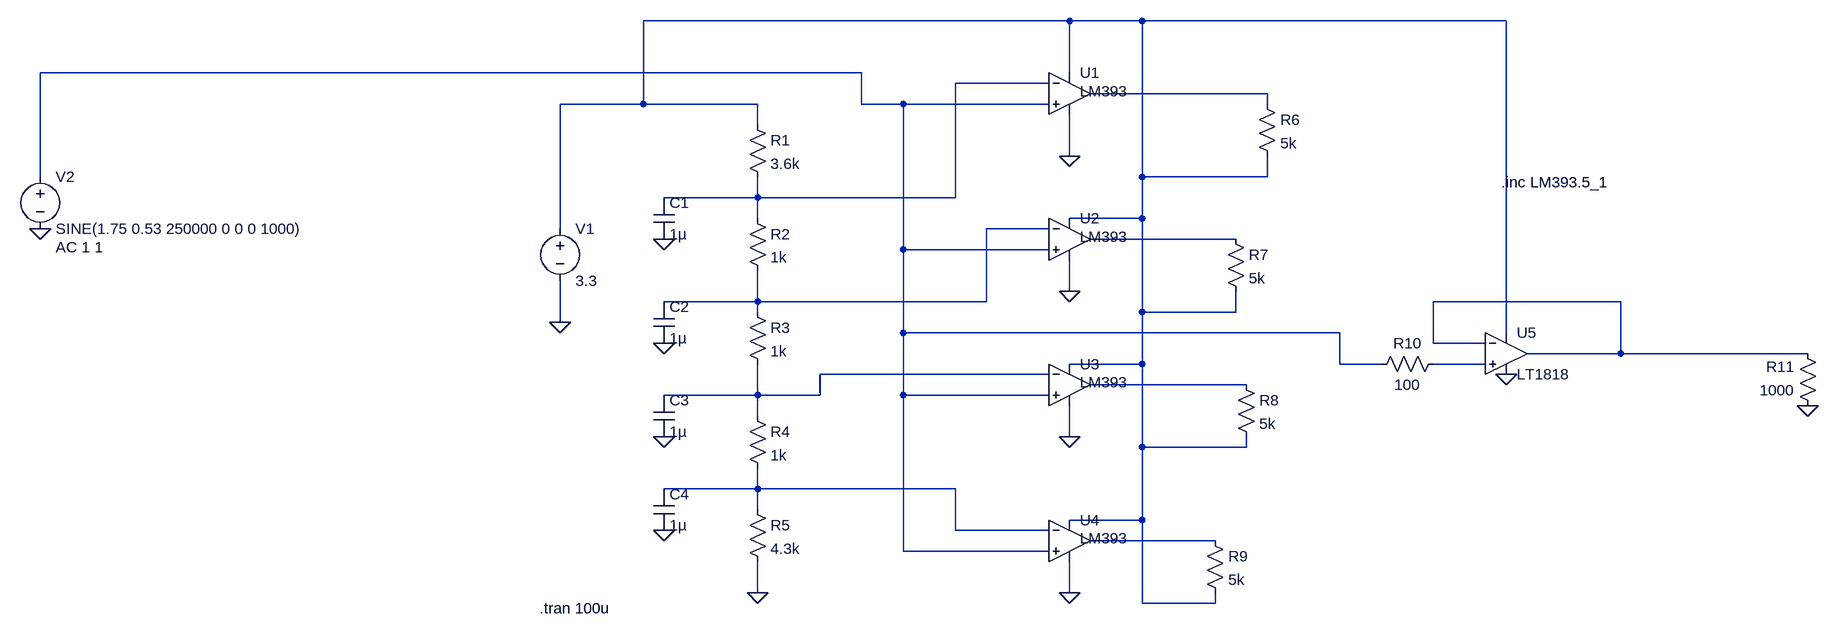
[diagram p0: schematic Comparator 2 bit ADC.asc]
Comparator 2 bit ADC.asc, the LTspice schematic file:
Version 4
SHEET 1 2020 728
WIRE 864 -192 208 -192
WIRE 976 -192 864 -192
WIRE 1536 -192 976 -192
WIRE 544 -112 -720 -112
WIRE 864 -112 864 -192
WIRE 832 -96 688 -96
WIRE 1168 -80 896 -80
WIRE 208 -64 208 -192
WIRE 208 -64 80 -64
WIRE 384 -64 208 -64
WIRE 544 -64 544 -112
WIRE 608 -64 544 -64
WIRE 832 -64 608 -64
WIRE 1168 -64 1168 -80
WIRE 384 -32 384 -64
WIRE 864 16 864 -48
WIRE -720 48 -720 -112
WIRE 976 48 976 -192
WIRE 1168 48 1168 16
WIRE 1168 48 976 48
WIRE 384 80 384 48
WIRE 384 80 240 80
WIRE 688 80 688 -96
WIRE 688 80 384 80
WIRE 384 112 384 80
WIRE 976 112 976 48
WIRE 976 112 864 112
WIRE 80 128 80 -64
WIRE 832 128 736 128
WIRE 1120 144 896 144
WIRE 608 160 608 -64
WIRE 832 160 608 160
WIRE 864 224 864 176
WIRE 384 240 384 192
WIRE 384 240 240 240
WIRE 736 240 736 128
WIRE 736 240 384 240
WIRE 1712 240 1424 240
WIRE 384 256 384 240
WIRE 976 256 976 112
WIRE 1120 256 1120 224
WIRE 1120 256 976 256
WIRE 80 272 80 208
WIRE 608 288 608 160
WIRE 1280 288 608 288
WIRE 1536 288 1536 -192
WIRE 1424 304 1424 240
WIRE 1504 304 1424 304
WIRE 1712 320 1712 240
WIRE 1712 320 1568 320
WIRE 2000 320 1712 320
WIRE 976 336 976 256
WIRE 976 336 864 336
WIRE 1280 336 1280 288
WIRE 1344 336 1280 336
WIRE 1504 336 1424 336
WIRE 832 352 480 352
WIRE 1136 368 896 368
WIRE 384 384 384 336
WIRE 384 384 240 384
WIRE 480 384 480 352
WIRE 480 384 384 384
WIRE 608 384 608 288
WIRE 832 384 608 384
WIRE 384 416 384 384
WIRE 864 448 864 400
WIRE 976 464 976 336
WIRE 1136 464 1136 448
WIRE 1136 464 976 464
WIRE 384 528 384 496
WIRE 384 528 240 528
WIRE 688 528 384 528
WIRE 384 560 384 528
WIRE 976 576 976 464
WIRE 976 576 864 576
WIRE 688 592 688 528
WIRE 832 592 688 592
WIRE 1088 608 896 608
WIRE 608 624 608 384
WIRE 832 624 608 624
WIRE 384 688 384 640
WIRE 864 688 864 640
WIRE 976 704 976 576
WIRE 1088 704 1088 688
WIRE 1088 704 976 704
FLAG 80 272 0
FLAG 384 688 0
FLAG 864 16 0
FLAG -720 128 0
FLAG 864 224 0
FLAG 864 448 0
FLAG 864 688 0
FLAG 240 144 0
FLAG 240 304 0
FLAG 240 448 0
FLAG 240 592 0
FLAG 1536 352 0
FLAG 2000 400 0
SYMBOL voltage 80 112 R0
WINDOW 123 0 0 Left 0
WINDOW 39 0 0 Left 0
SYMATTR InstName V1
SYMATTR Value 3.3
SYMBOL res 368 -48 R0
SYMATTR InstName R1
SYMATTR Value 3.6k
SYMBOL res 368 96 R0
SYMATTR InstName R2
SYMATTR Value 1k
SYMBOL res 368 240 R0
SYMATTR InstName R3
SYMATTR Value 1k
SYMBOL res 368 400 R0
SYMATTR InstName R4
SYMATTR Value 1k
SYMBOL res 368 544 R0
SYMATTR InstName R5
SYMATTR Value 4.3k
SYMBOL res 1152 -80 R0
SYMATTR InstName R6
SYMATTR Value 5k
SYMBOL voltage -720 32 R0
WINDOW 123 24 124 Left 2
WINDOW 39 0 0 Left 0
SYMATTR Value2 AC 1 1
SYMATTR InstName V2
SYMATTR Value SINE(1.75 0.53 250000 0 0 0 1000)
SYMBOL res 1104 128 R0
SYMATTR InstName R7
SYMATTR Value 5k
SYMBOL res 1120 352 R0
SYMATTR InstName R8
SYMATTR Value 5k
SYMBOL res 1072 592 R0
SYMATTR InstName R9
SYMATTR Value 5k
SYMBOL cap 224 80 R0
SYMATTR InstName C1
SYMATTR Value 1µ
SYMBOL cap 224 240 R0
SYMATTR InstName C2
SYMATTR Value 1µ
SYMBOL cap 224 384 R0
SYMATTR InstName C3
SYMATTR Value 1µ
SYMBOL cap 224 528 R0
SYMATTR InstName C4
SYMATTR Value 1µ
SYMBOL OpAmps\\UniversalOpAmp2 864 -80 R0
WINDOW 3 16 -4 Left 2
SYMATTR Value LM393
SYMATTR InstName U1
SYMATTR SpiceModel ""
SYMATTR Value2 ""
SYMATTR SpiceLine ""
SYMATTR SpiceLine2 ""
SYMBOL OpAmps\\UniversalOpAmp2 864 144 R0
WINDOW 3 16 -4 Left 2
SYMATTR Value LM393
SYMATTR InstName U2
SYMATTR SpiceModel ""
SYMATTR Value2 ""
SYMATTR SpiceLine ""
SYMATTR SpiceLine2 ""
SYMBOL OpAmps\\UniversalOpAmp2 864 368 R0
WINDOW 3 16 -4 Left 2
SYMATTR Value LM393
SYMATTR InstName U3
SYMATTR SpiceModel ""
SYMATTR Value2 ""
SYMATTR SpiceLine ""
SYMATTR SpiceLine2 ""
SYMBOL OpAmps\\UniversalOpAmp2 864 608 R0
WINDOW 3 16 -4 Left 2
SYMATTR Value LM393
SYMATTR InstName U4
SYMATTR SpiceModel ""
SYMATTR Value2 ""
SYMATTR SpiceLine ""
SYMATTR SpiceLine2 ""
SYMBOL OpAmps\\LT1818 1536 320 R0
SYMATTR InstName U5
SYMBOL res 1440 320 R90
WINDOW 0 0 56 VBottom 2
WINDOW 3 32 56 VTop 2
SYMATTR InstName R10
SYMATTR Value 100
SYMBOL res 2016 416 R180
WINDOW 0 36 76 Left 2
WINDOW 3 36 40 Left 2
SYMATTR InstName R11
SYMATTR Value 1000
TEXT 48 712 Left 2 !.tran 100u
TEXT 1528 56 Left 2 !.inc LM393.5_1

The netlist it stands for:
* Comparator 2 bit ADC.asc
V1 N001 0 3.3
R1 N001 N003 3.6k
R2 N003 N005 1k
R3 N005 N009 1k
R4 N009 N011 1k
R5 N011 0 4.3k
R6 N004 N001 5k
V2 N002 0 SINE(1.75 0.53 250000 0 0 0 1000) AC 1 1
R7 N006 N001 5k
R8 N010 N001 5k
R9 N012 N001 5k
C1 N003 0 1µ
C2 N005 0 1µ
C3 N009 0 1µ
C4 N011 0 1µ
XU1 N002 N003 N001 0 N004 LM393  ; pins In+ In- V+ V- OUT
XU2 N002 N005 N001 0 N006 LM393  ; pins In+ In- V+ V- OUT
XU3 N002 N009 N001 0 N010 LM393  ; pins In+ In- V+ V- OUT
XU4 N002 N011 N001 0 N012 LM393  ; pins In+ In- V+ V- OUT
XU5 N008 N007 N007 N001 0 LT1818  ; pins In+ In- OUT V+ V-
R10 N008 N002 100
R11 0 N007 1000
.tran 100u
.inc LM393.5_1
.lib UniversalOpAmp2.lib
.lib LTC2.lib
.backanno
.end